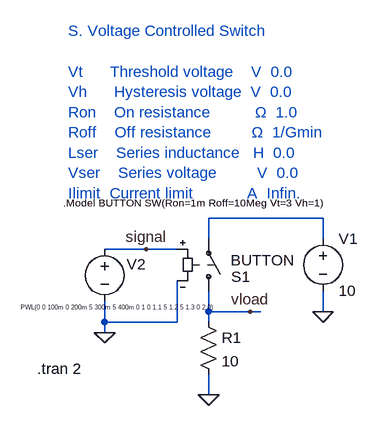
[diagram p0: schematic 11-ltspice_switch.asc]
11-ltspice_switch.asc, the LTspice schematic file:
Version 4
SHEET 1 900 680
WIRE 384 64 208 64
WIRE 208 96 208 64
WIRE 384 96 384 64
WIRE 112 112 48 112
WIRE 160 112 112 112
WIRE 208 208 208 176
WIRE 272 208 208 208
WIRE 288 208 272 208
WIRE 384 208 384 176
WIRE 48 224 48 192
WIRE 160 224 160 160
WIRE 160 224 48 224
WIRE 208 224 208 208
WIRE 48 240 48 224
WIRE 208 336 208 304
FLAG 208 336 0
FLAG 48 240 0
FLAG 384 208 0
FLAG 272 208 vload
FLAG 112 112 signal
SYMBOL sw 208 192 M180
WINDOW 0 35 38 Left 2
WINDOW 3 34 63 Left 2
SYMATTR InstName S1
SYMATTR Value BUTTON
SYMBOL voltage 384 80 R0
WINDOW 123 0 0 Left 0
WINDOW 39 0 0 Left 0
SYMATTR InstName V1
SYMATTR Value 10
SYMBOL res 192 208 R0
SYMATTR InstName R1
SYMATTR Value 10
SYMBOL voltage 48 96 R0
WINDOW 0 34 39 Left 2
WINDOW 3 -129 105 Left 0
WINDOW 123 0 0 Left 0
WINDOW 39 0 0 Left 0
SYMATTR InstName V2
SYMATTR Value PWL(0 0 100m 0 200m 5 300m 5 400m 0 1 0 1.1 5 1.2 5 1.3 0 2 0)
TEXT -16 40 Left 1 !.Model BUTTON SW(Ron=1m Roff=10Meg Vt=3 Vh=1)
TEXT -56 296 Left 2 !.tran 2
TEXT -8 -224 Left 2 ;S. Voltage Controlled Switch\n \nVt      Threshold voltage    V  0.0\nVh      Hysteresis voltage  V  0.0\nRon    On resistance          Ω  1.0\nRoff    Off resistance         Ω  1/Gmin\nLser    Series inductance   H  0.0\nVser    Series voltage         V  0.0\nIlimit  Current limit            A  Infin.

The netlist it stands for:
* 11-ltspice_switch.asc
S1 vload N001 signal 0 BUTTON
V1 N001 0 10
R1 vload 0 10
V2 signal 0 PWL(0 0 100m 0 200m 5 300m 5 400m 0 1 0 1.1 5 1.2 5 1.3 0 2 0)
.Model BUTTON SW(Ron=1m Roff=10Meg Vt=3 Vh=1)
.tran 2
* S. Voltage Controlled Switch
* Vt      Threshold voltage    V  0.0
* Vh      Hysteresis voltage  V  0.0
* Ron    On resistance          Ω  1.0
* Roff    Off resistance         Ω  1/Gmin
* Lser    Series inductance   H  0.0
* Vser    Series voltage         V  0.0
* Ilimit  Current limit            A  Infin.
.backanno
.end

* Results of the author's LTspice run, read from the files saved beside the schematic
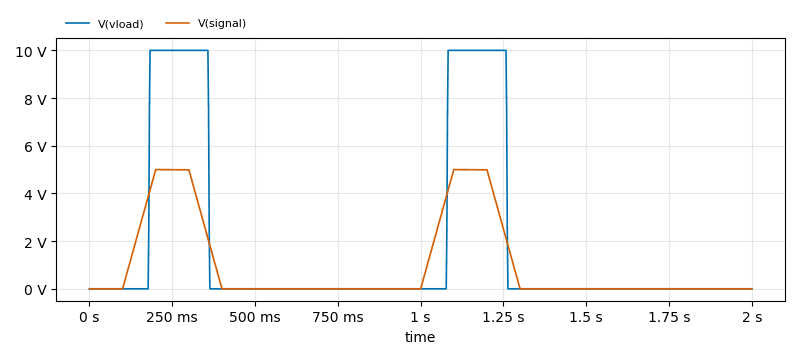
[diagram p1: Transient Analysis of 11-ltspice_switch.asc, plotted from the saved traces]
* Transient Analysis, 1 run:
*   V(vload): min 10 µV, max 9.999 V, average 1.805 V, rms 4.23 V, last 10 µV
*   V(signal): min 0 V, max 5 V, average 999.4 mV, rms 2.11 V, last 0 V